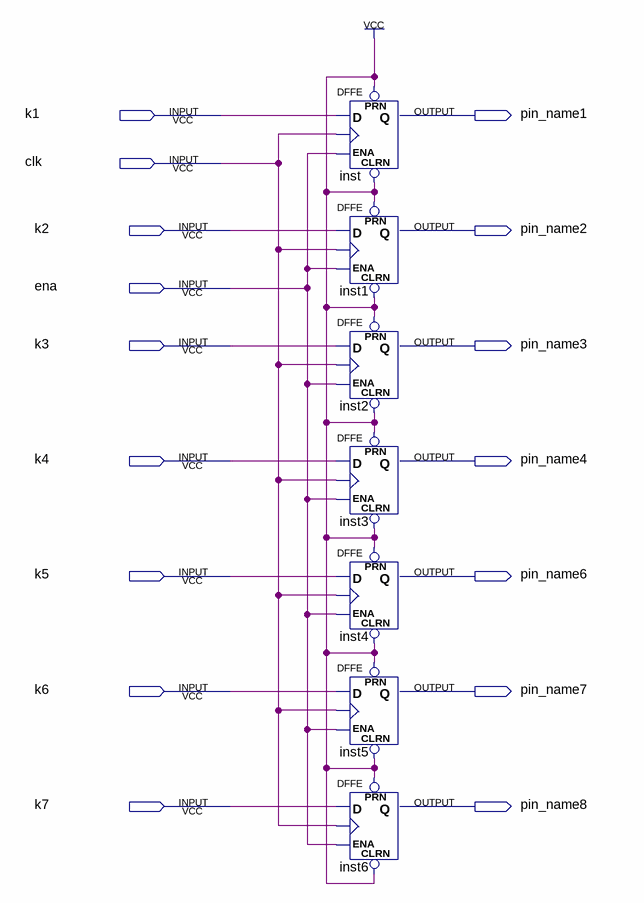
[diagram p0: schematic sheet]
// Quartus schematic keyEnabler.bdf as structural Verilog: 7 symbols, 16 pins
module keyEnabler (
  input  k1,
  input  clk,
  input  k2,
  input  ena,
  input  k3,
  input  k4,
  input  k5,
  input  k6,
  input  k7,
  output pin_name1,
  output pin_name2,
  output pin_name3,
  output pin_name4,
  output pin_name6,
  output pin_name7,
  output pin_name8
);

  DFFE inst (.PRN(1'b1), .CLRN(1'b1), .D(k1), .CLK(clk), .ENA(ena), .Q(pin_name1));
  DFFE inst1 (.PRN(1'b1), .CLRN(1'b1), .D(k2), .CLK(clk), .ENA(ena), .Q(pin_name2));
  DFFE inst2 (.PRN(1'b1), .CLRN(1'b1), .D(k3), .CLK(clk), .ENA(ena), .Q(pin_name3));
  DFFE inst3 (.PRN(1'b1), .CLRN(1'b1), .D(k4), .CLK(clk), .ENA(ena), .Q(pin_name4));
  DFFE inst4 (.PRN(1'b1), .CLRN(1'b1), .D(k5), .CLK(clk), .ENA(ena), .Q(pin_name6));
  DFFE inst5 (.PRN(1'b1), .CLRN(1'b1), .D(k6), .CLK(clk), .ENA(ena), .Q(pin_name7));
  DFFE inst6 (.PRN(1'b1), .CLRN(1'b1), .D(k7), .CLK(clk), .ENA(ena), .Q(pin_name8));
endmodule
